# Altium schematic sheet Power Outputs.SchDoc
size A4; SheetNumber: 5; SheetTotal: 9
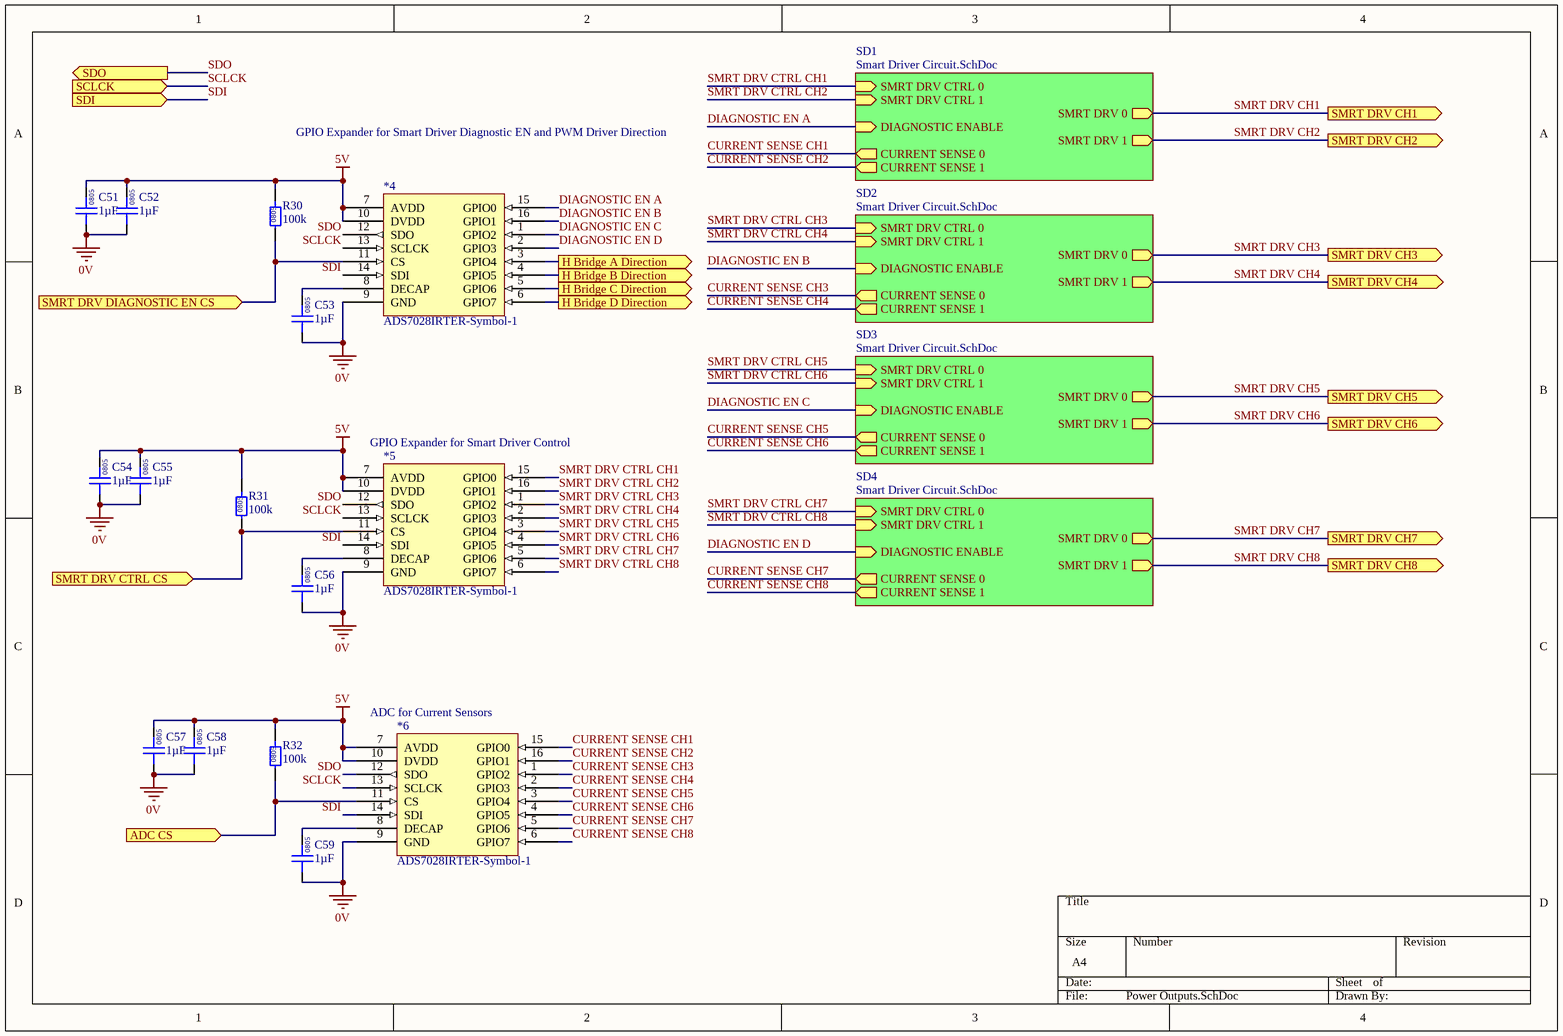
[diagram p0: Power Outputs.SchDoc]

## Parts
*4  ADS7028IRTER-Symbol-1  [QFN50P300X300X80_HS-17N]
*5  ADS7028IRTER-Symbol-1  [QFN50P300X300X80_HS-17N]
*6  ADS7028IRTER-Symbol-1  [QFN50P300X300X80_HS-17N]
C51  1µF  [0805]
C52  1µF  [0805]
C53  1µF  [0805]
C54  1µF  [0805]
C55  1µF  [0805]
C56  1µF  [0805]
C57  1µF  [0805]
C58  1µF  [0805]
C59  1µF  [0805]
R30  100k  [0805]
R31  100k  [0805]
R32  100k  [0805]

## Sub-sheets
SD1 = Smart Driver Circuit.SchDoc: SMRT DRV CTRL 0 (in), SMRT DRV CTRL 1 (in), CURRENT SENSE 0 (out), CURRENT SENSE 1 (out), DIAGNOSTIC ENABLE (in), SMRT DRV 0 (out), SMRT DRV 1 (out)
SD2 = Smart Driver Circuit.SchDoc: SMRT DRV CTRL 0 (in), SMRT DRV CTRL 1 (in), CURRENT SENSE 0 (out), CURRENT SENSE 1 (out), DIAGNOSTIC ENABLE (in), SMRT DRV 0 (out), SMRT DRV 1 (out)
SD3 = Smart Driver Circuit.SchDoc: SMRT DRV CTRL 0 (in), SMRT DRV CTRL 1 (in), CURRENT SENSE 0 (out), CURRENT SENSE 1 (out), DIAGNOSTIC ENABLE (in), SMRT DRV 0 (out), SMRT DRV 1 (out)
SD4 = Smart Driver Circuit.SchDoc: SMRT DRV CTRL 0 (in), SMRT DRV CTRL 1 (in), CURRENT SENSE 0 (out), CURRENT SENSE 1 (out), DIAGNOSTIC ENABLE (in), SMRT DRV 0 (out), SMRT DRV 1 (out)

## Ports
ADC CS (in), H Bridge A Direction (out), H Bridge B Direction (out), H Bridge C Direction (out), H Bridge D Direction (out), SCLCK (in), SDI (in), SDO (out), SMRT DRV CH1 (out), SMRT DRV CH2 (out), SMRT DRV CH3 (out), SMRT DRV CH4 (out), SMRT DRV CH5 (out), SMRT DRV CH6 (out), SMRT DRV CH7 (out), SMRT DRV CH8 (out), SMRT DRV CTRL CS (in), SMRT DRV DIAGNOSTIC EN CS (in)

## Nets
0V: *4.9(GND) *5.9(GND) *6.9(GND) C51.1 C52.1 C53.1 C54.1 C55.1 C56.1 C57.1 C58.1 C59.1
5V: *4.7(AVDD) *4.10(DVDD) *5.7(AVDD) *5.10(DVDD) *6.7(AVDD) *6.10(DVDD) C51.2 C52.2 C54.2 C55.2 C57.2 C58.2 R30.2 R31.2 R32.2
ADC CS: *6.11(CS) R32.1 ; port ADC CS
CURRENT SENSE CH1: *6.15(GPIO0) ; sheet SD1/CURRENT SENSE 0
CURRENT SENSE CH2: *6.16(GPIO1) ; sheet SD1/CURRENT SENSE 1
CURRENT SENSE CH3: *6.1(GPIO2) ; sheet SD2/CURRENT SENSE 0
CURRENT SENSE CH4: *6.2(GPIO3) ; sheet SD2/CURRENT SENSE 1
CURRENT SENSE CH5: *6.3(GPIO4) ; sheet SD3/CURRENT SENSE 0
CURRENT SENSE CH6: *6.4(GPIO5) ; sheet SD3/CURRENT SENSE 1
CURRENT SENSE CH7: *6.5(GPIO6) ; sheet SD4/CURRENT SENSE 0
CURRENT SENSE CH8: *6.6(GPIO7) ; sheet SD4/CURRENT SENSE 1
DIAGNOSTIC EN A: *4.15(GPIO0) ; sheet SD1/DIAGNOSTIC ENABLE
DIAGNOSTIC EN B: *4.16(GPIO1) ; sheet SD2/DIAGNOSTIC ENABLE
DIAGNOSTIC EN C: *4.1(GPIO2) ; sheet SD3/DIAGNOSTIC ENABLE
DIAGNOSTIC EN D: *4.2(GPIO3) ; sheet SD4/DIAGNOSTIC ENABLE
H Bridge A Direction: *4.3(GPIO4) ; port H Bridge A Direction
H Bridge B Direction: *4.4(GPIO5) ; port H Bridge B Direction
H Bridge C Direction: *4.5(GPIO6) ; port H Bridge C Direction
H Bridge D Direction: *4.6(GPIO7) ; port H Bridge D Direction
SCLCK: *4.13(SCLCK) *5.13(SCLCK) *6.13(SCLCK) ; port SCLCK
SDI: *4.14(SDI) *5.14(SDI) *6.14(SDI) ; port SDI
SDO: *4.12(SDO) *5.12(SDO) *6.12(SDO) ; port SDO
SMRT DRV CH1: port SMRT DRV CH1, sheet SD1/SMRT DRV 0
SMRT DRV CH2: port SMRT DRV CH2, sheet SD1/SMRT DRV 1
SMRT DRV CH3: port SMRT DRV CH3, sheet SD2/SMRT DRV 0
SMRT DRV CH4: port SMRT DRV CH4, sheet SD2/SMRT DRV 1
SMRT DRV CH5: port SMRT DRV CH5, sheet SD3/SMRT DRV 0
SMRT DRV CH6: port SMRT DRV CH6, sheet SD3/SMRT DRV 1
SMRT DRV CH7: port SMRT DRV CH7, sheet SD4/SMRT DRV 0
SMRT DRV CH8: port SMRT DRV CH8, sheet SD4/SMRT DRV 1
SMRT DRV CTRL CH1: *5.15(GPIO0) ; sheet SD1/SMRT DRV CTRL 0
SMRT DRV CTRL CH2: *5.16(GPIO1) ; sheet SD1/SMRT DRV CTRL 1
SMRT DRV CTRL CH3: *5.1(GPIO2) ; sheet SD2/SMRT DRV CTRL 0
SMRT DRV CTRL CH4: *5.2(GPIO3) ; sheet SD2/SMRT DRV CTRL 1
SMRT DRV CTRL CH5: *5.3(GPIO4) ; sheet SD3/SMRT DRV CTRL 0
SMRT DRV CTRL CH6: *5.4(GPIO5) ; sheet SD3/SMRT DRV CTRL 1
SMRT DRV CTRL CH7: *5.5(GPIO6) ; sheet SD4/SMRT DRV CTRL 0
SMRT DRV CTRL CH8: *5.6(GPIO7) ; sheet SD4/SMRT DRV CTRL 1
SMRT DRV CTRL CS: *5.11(CS) R31.1 ; port SMRT DRV CTRL CS
SMRT DRV DIAGNOSTIC EN CS: *4.11(CS) R30.1 ; port SMRT DRV DIAGNOSTIC EN CS
Net*4_8: *4.8(DECAP) C53.2
Net*5_8: *5.8(DECAP) C56.2
Net*6_8: *6.8(DECAP) C59.2

## Notes on the sheet
- GPIO Expander for Smart Driver Diagnostic EN and PWM Driver Direction
- (near *5) GPIO Expander for Smart Driver Control
- (near *6) ADC for Current Sensors
- (in symbol GCM21BR71H105KA03L) 0805
- (in symbol RC0805FR07100KL) 0805

## Library data of the parts
*4-*6 = ADS7028IRTER: IC ADC 12BIT SAR 16WQFN; Manufacturer: Texas Instruments; Part Number: ADS7028IRTER; Digikey Part Number: ADS7028IRTER; Digikey Link: https://www.digikey.com.au/en/products/detail/texas-instruments/ADS7028IRTER/12696020?s=N4IgTCBcDaIIIBEDKB2ADGAHASQEoBUBRXEAXQF8g
C51-C59 = GCM21BR71H105KA03L: Manufacturer: muRata; Rated Voltage: 50V; Tolerance: ±10%; Material: MLCC; Temperature Rating: X7R; Part Number: GCM21BR71H105KA03L; Value: 1µF; Digikey Part Number: 490-10675-1-ND
R30-R32 = RC0805FR07100KL: Manufacturer: YAGEO; Tolerance: 0.01; Rated Power: 0.125W; Part Number: RC0805FR07100KL; Value: 100k; Material: FR-07; Digikey Part Number: 311-100KCRCT-ND